# EasyEDA schematic SCH_Senior_Transmitter_2026-04-06.json
TITLE: Transmitter; REV: 1.0; Date: 2026-04-04; Sheet: 1/1; Company: Your Company
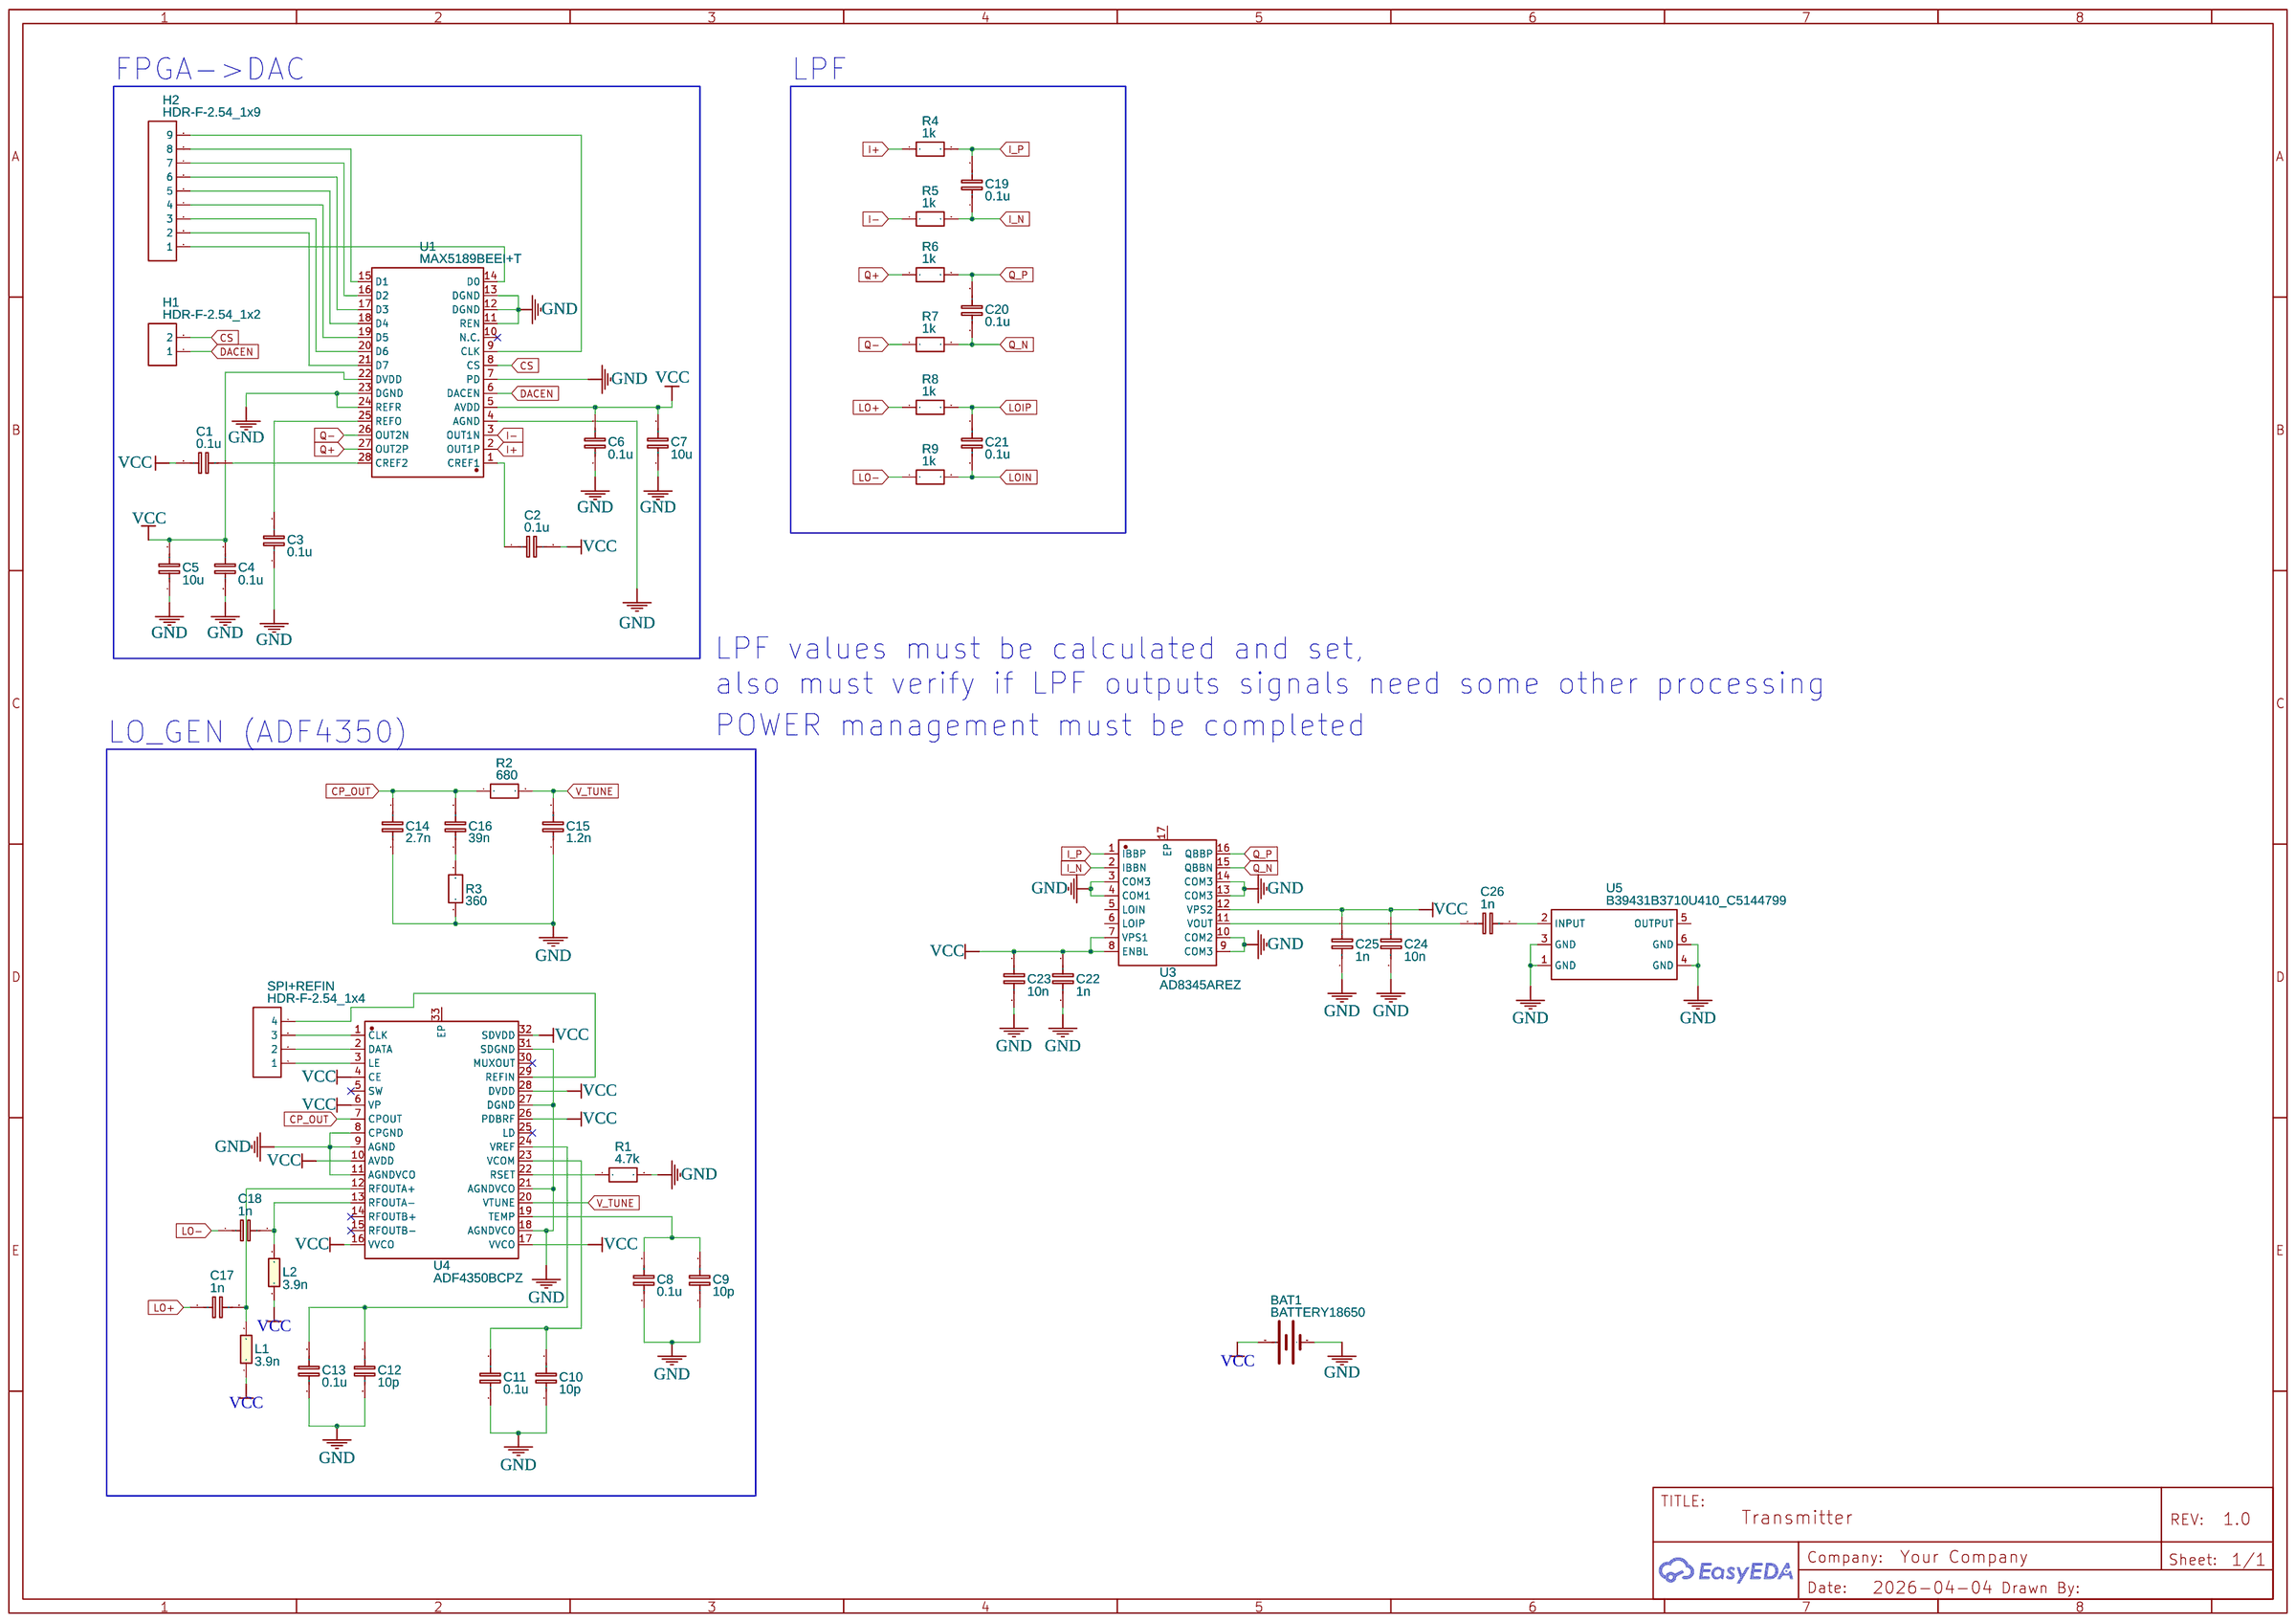
[diagram p0: schematic sheet]

## Parts
BAT1  BATTERY18650  [BATTERY_18650-HOLDER]
C1  0.1u  [C0603]
C2  0.1u  [C0603]
C3  0.1u  [C0603]
C4  0.1u  [C0603]
C5  10u  [C0603]
C6  0.1u  [C0603]
C7  10u  [C0603]
C8  0.1u  [C0603]
C9  10p  [C0603]
C10  10p  [C0603]
C11  0.1u  [C0603]
C12  10p  [C0603]
C13  0.1u  [C0603]
C14  2.7n  [C0603]
C15  1.2n  [C0603]
C16  39n  [C0603]
C17  1n  [C0603]
C18  1n  [C0603]
C19  0.1u  [C0603]
C20  0.1u  [C0603]
C21  0.1u  [C0603]
C22  1n  [C0603]
C23  10n  [C0603]
C24  10n  [C0603]
C25  1n  [C0603]
C26  1n  [C0603]
H1  HDR-F-2.54_1x2  [HDR-F-2.54_1X2]
H2  HDR-F-2.54_1x9  [HDR-F-2.54_1X9]
L1  3.9n  [L0603]
L2  3.9n  [L0603]
R1  4.7k  [R0603]
R2  680  [R0603]
R3  360  [R0603]
R4  1k  [R0603]
R5  1k  [R0603]
R6  1k  [R0603]
R7  1k  [R0603]
R8  1k  [R0603]
R9  1k  [R0603]
SPI+REFIN  HDR-F-2.54_1x4  [HDR-F-2.54_1X4]
U1  MAX5189BEEI+T  [QSOP-28_L9.8-W3.99-P0.635-LS6.2-TL]
U3  AD8345AREZ  [TSSOP-16_L5.0-W4.4-P0.65-LS6.4-BL-EP2.8]
U4  ADF4350BCPZ  [LFCSP-32_L5.0-W5.0-P0.50-TL-EP3.1]
U5  B39431B3710U410_C5144799  [OSC-SMD_6P-L3.0-W3.0-BL-1]

## Library data of the parts
BAT1 = BATTERY18650: Battery Holders; Contributor: SparkFun
C1-C26 = C_0603_EU: Contributor: LCEDA_Lib
H1 = HDR-F-2.54_1x2: Supplier Part: C49661; Supplier: LCSC; Contributor: LCEDA_Lib
H2 = HDR-F-2.54_1x9: Supplier Part: C124417; Supplier: LCSC; Contributor: LCEDA_Lib
L1 L2 = L0603_EU: Contributor: LCEDA_Lib
R1-R9 = R_0603_EU: Contributor: LCEDA_Lib
SPI+REFIN = HDR-F-2.54_1x4: Supplier Part: C225501; Supplier: LCSC; Contributor: LCEDA_Lib
U1 = MAX5189BEEI+T: Contributor: LCSC; Supplier: LCSC; Supplier Part: C2679726; Manufacturer: ADI(亚德诺)/MAXIM(美信); JLCPCB Part Class: Extended Part
U3 = AD8345AREZ: Contributor: LCSC; Supplier: LCSC; Supplier Part: C652725; Manufacturer: ADI(亚德诺)
U4 = ADF4350BCPZ: Contributor: LCSC; Supplier: LCSC; Supplier Part: C578982; Manufacturer: ADI(亚德诺); JLCPCB Part Class: Extended Part
U5 = B39431B3710U410_C5144799: Contributor: lcsc; Supplier: LCSC; Supplier Part: C5144799; Manufacturer: null; Manufacturer Part: B39431B3710U410; JLCPCB Part Class: Extended Part

## Nets
GND: BAT1.GND@1(-) C3.1 C4.1 C5.1 C6.1 C7.1 C8.1 C9.1 C10.1 C11.1 C12.1 C13.1 C14.1 C15.1 C22.2 C23.2 C24.2 C25.2 R1.2 R3.1 U1.4(AGND) U1.7(PD) U1.11(REN) U1.12(DGND) U1.13(DGND) U1.23(DGND) U1.24(REFR) U3.3(COM3) U3.4(COM1) U3.9(COM3) U3.10(COM2) U3.13(COM3) U3.14(COM3) U4.8(CPGND) U4.9(AGND) U4.11(AGNDVCO) U4.18(AGNDVCO) U4.21(AGNDVCO) U4.27(DGND) U4.31(SDGND) U5.1(GND) U5.3(GND) U5.4(GND) U5.6(GND)
VCC: BAT1.PWR@1(+) C1.1 C2.2 C4.2 C5.2 C6.2 C7.2 C22.1 C23.1 C24.1 C25.1 L1.1 L2.1 U1.5(AVDD) U1.22(DVDD) U3.7(VPS1) U3.8(ENBL) U3.12(VPS2) U4.4(CE) U4.6(VP) U4.10(AVDD) U4.16(VVCO) U4.17(VVCO) U4.26(PDBRF) U4.28(DVDD) U4.32(SDVDD)
CP_OUT: C14.2 C16.2 R2.1 U4.7(CPOUT)
CS: H1.2 U1.8(CS)
DACEN: H1.1 U1.6(DACEN)
I+: R4.1 U1.2(OUT1P)
I-: R5.1 U1.3(OUT1N)
I_N: C19.1 R5.2 U3.2(IBBN)
I_P: C19.2 R4.2 U3.1(IBBP)
LO+: C17.1 R8.1
LO-: C18.1 R9.1
LOIN: C21.1 R9.2
LOIP: C21.2 R8.2
Q+: R6.1 U1.27(OUT2P)
Q-: R7.1 U1.26(OUT2N)
Q_N: C20.1 R7.2 U3.15(QBBN)
Q_P: C20.2 R6.2 U3.16(QBBP)
V_TUNE: C15.2 R2.2 U4.20(VTUNE)
Net-(C1-2): C1.2 U1.28(CREF2)
Net-(C2-1): C2.1 U1.1(CREF1)
Net-(C3-2): C3.2 U1.25(REFO)
Net-(C8-2): C8.2 C9.2 U4.19(TEMP)
Net-(C10-2): C10.2 C11.2 U4.23(VCOM)
Net-(C12-2): C12.2 C13.2 U4.24(VREF)
Net-(C16-1): C16.1 R3.2
Net-(C17-2): C17.2 L1.2 U4.12(RFOUTA+)
Net-(C18-2): C18.2 L2.2 U4.13(RFOUTA-)
Net-(C26-1): C26.1 U3.11(VOUT)
Net-(C26-2): C26.2 U5.2(INPUT)
Net-(H2-1): H2.1 U1.14(D0)
Net-(H2-2): H2.2 U1.21(D7)
Net-(H2-3): H2.3 U1.20(D6)
Net-(H2-4): H2.4 U1.19(D5)
Net-(H2-5): H2.5 U1.18(D4)
Net-(H2-6): H2.6 U1.17(D3)
Net-(H2-7): H2.7 U1.16(D2)
Net-(H2-8): H2.8 U1.15(D1)
Net-(H2-9): H2.9 U1.9(CLK)
Net-(R1-1): R1.1 U4.22(RSET)
Net-(SPI+REFIN-1): SPI+REFIN.1 U4.3(LE)
Net-(SPI+REFIN-2): SPI+REFIN.2 U4.2(DATA)
Net-(SPI+REFIN-3): SPI+REFIN.3 U4.1(CLK)
Net-(SPI+REFIN-4): SPI+REFIN.4 U4.29(REFIN)

Not connected (* = marked no-connect by the designer): U1 10(N.C.)*; U3 5(LOIN) 6(LOIP) 17(EP); U4 5(SW)* 14(RFOUTB+)* 15(RFOUTB-)* 25(LD)* 30(MUXOUT)* 33(EP); U5 5(OUTPUT)

## Notes on the sheet
- FPGA->DAC
- LPF
- LPF values must be calculated and set,
- also must verify if LPF outputs signals need some other processing
- LO_GEN (ADF4350)
- POWER management must be completed
